# EAGLE design microBoard_DRV8843 (EAGLE 6.2)
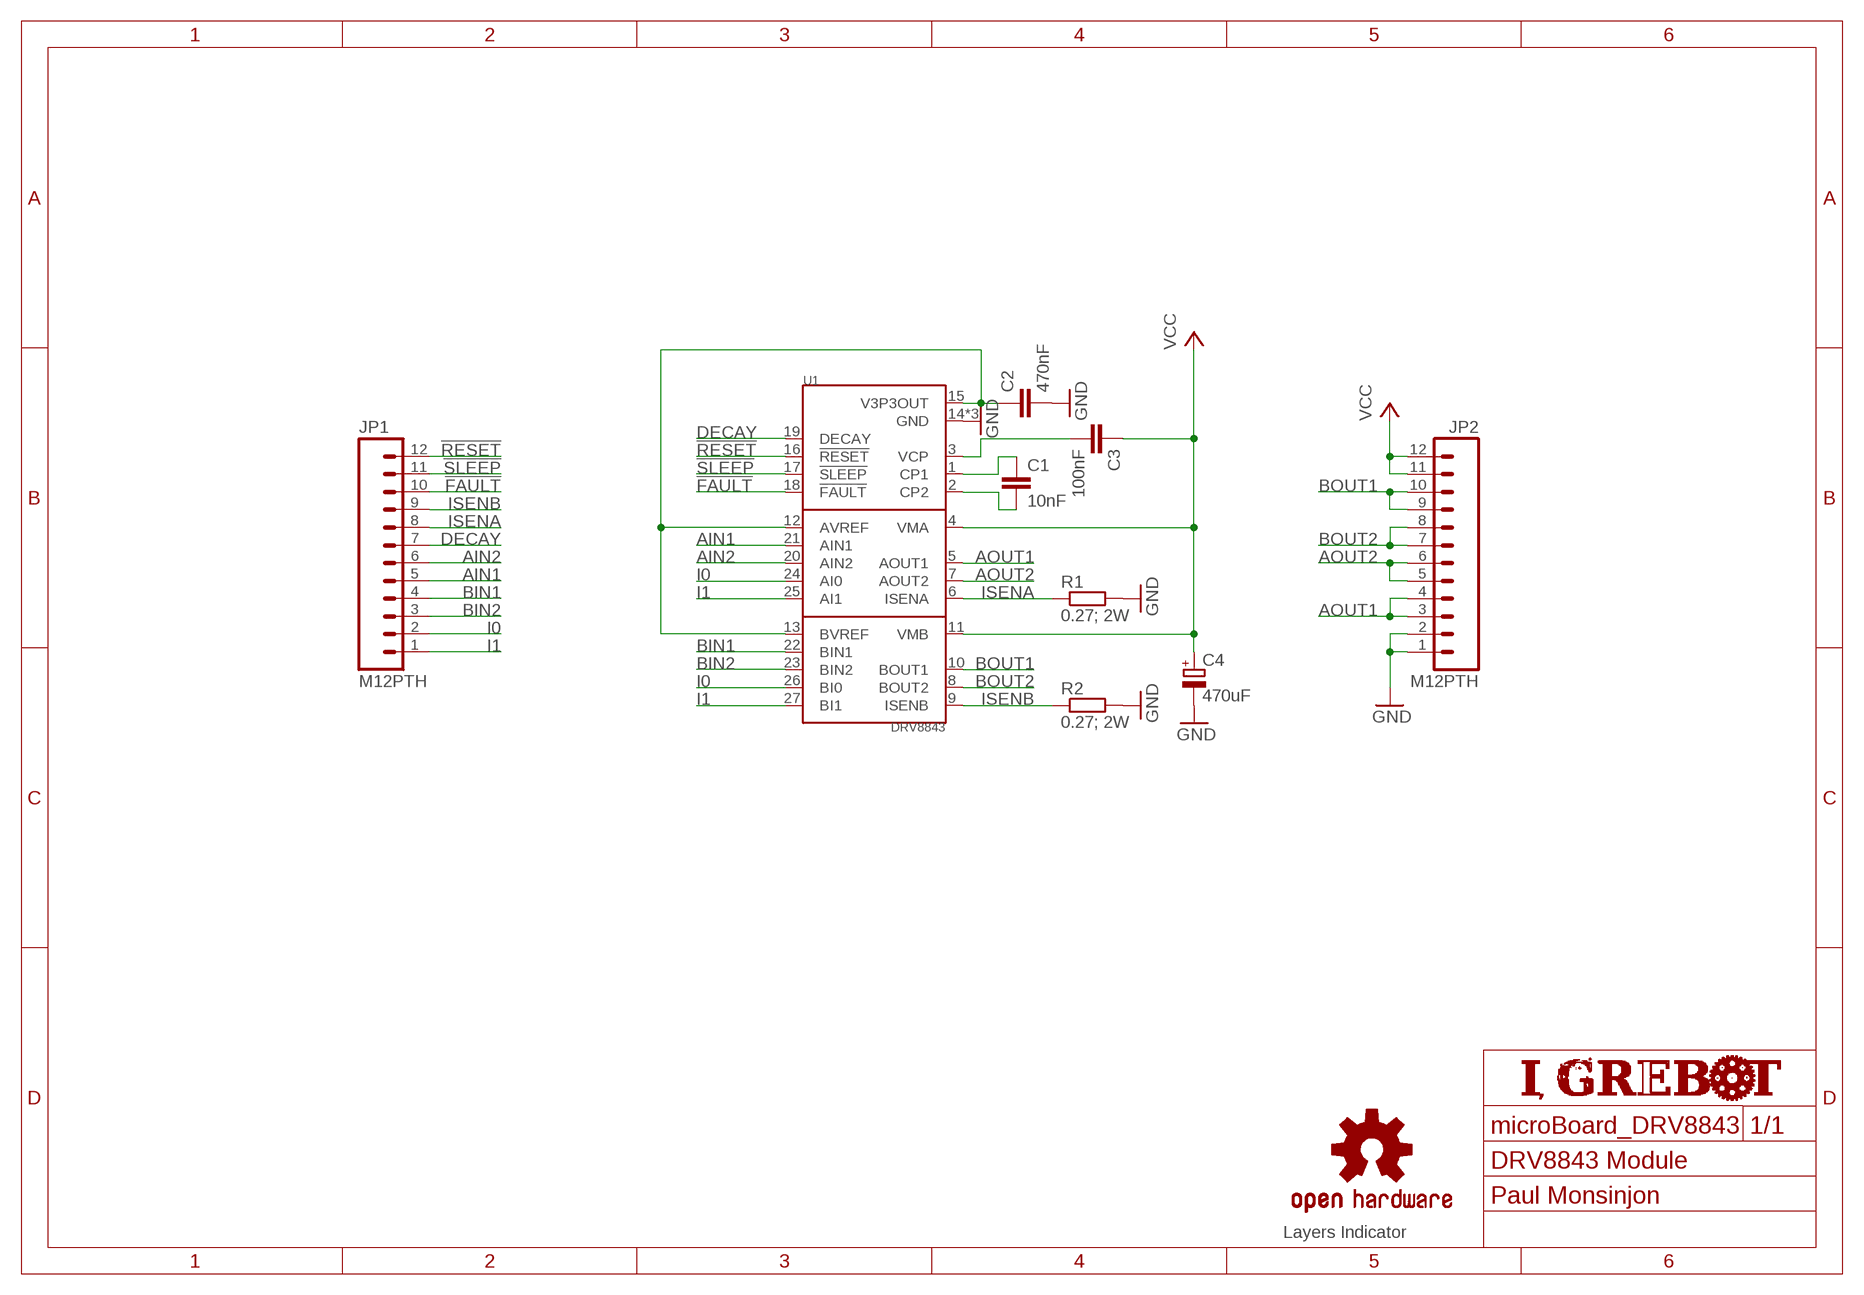
[diagram p0: schematic, sheet 1]
FRAME1 (FRAME_A4): AUTHOR: Paul Monsinjon; SHEET_NAME: DRV8843 Module

## Parts
C1  10nF  C-EUC0603  [C0603]
C2  470nF  C-EUC0603  [C0603]
C3  100nF  C-EUC0603  [C0603]
C4  470uF  CPOL-EUD  [PANASONIC_D]
JP1  M12PTH  [1X12]
JP2  M12PTH  [1X12]
LOGO1  OSHW-LOGOS  [OSHW-LOGO-S]
R1  0.27; 2W  R-EU_R2010  [R2010]
R2  0.27; 2W  R-EU_R2010  [R2010]
U1  DRV8843  [PWP_28]
U$1  LOGO_IGREBOT12X2MM  [IGREBOT_12X2MM]
U$2  LAYERS_CHECK4_LAYERS  [LAYERS_CHECK_4]

## Nets
!FAULT!: JP1.10 U1.18(!FAULT!)
!RESET!: JP1.12 U1.16(!RESET!)
!SLEEP!: JP1.11 U1.17(!SLEEP!)
AIN1: JP1.5 U1.21(AIN1)
AIN2: JP1.6 U1.20(AIN2)
AOUT1: JP2.3 JP2.4 U1.5(AOUT1)
AOUT2: JP2.5 JP2.6 U1.7(AOUT2)
BIN1: JP1.4 U1.22(BIN1)
BIN2: JP1.3 U1.23(BIN2)
BOUT1: JP2.9 JP2.10 U1.10(BOUT1)
BOUT2: JP2.7 JP2.8 U1.8(BOUT2)
DECAY: JP1.7 U1.19(DECAY)
GND: C2.2 C4.- JP2.1 JP2.2 R1.2 R2.2 U1.14(GND) U1.28(GND) U1.PPAD(GND)
I0: JP1.2 U1.24(AI0) U1.26(BI0)
I1: JP1.1 U1.25(AI1) U1.27(BI1)
ISENA: JP1.8 R1.1 U1.6(ISENA)
ISENB: JP1.9 R2.1 U1.9(ISENB)
N$29: C1.2 U1.2(CP2)
N$30: C1.1 U1.1(CP1)
N$31: C3.2 U1.3(VCP)
N$32: C2.1 U1.12(AVREF) U1.13(BVREF) U1.15(V3P3OUT)
VCC: C3.1 C4.+ JP2.11 JP2.12 U1.4(VMA) U1.11(VMB)

## Library data of the parts
C1-C3 = rcl:C-EU: CAPACITOR, European symbol
C4 = rcl:CPOL-EU: POLARIZED CAPACITOR, European symbol
JP1 JP2 = SparkFun-Connectors:M12: Header 12 Standard 12-pin 0.1" header. Use with straight break away headers (SKU : PRT-00116), right angle break away headers (PRT-00553), swiss pins (PRT-00743), machine pins (PRT-00117), and female headers (PRT-00115).
LOGO1 = SparkFun-Aesthetics:OSHW-LOGO: Open Source Hardware Logo This logo indicates the piece of hardware it is found on incorporates a OSHW license and/or adheres to the definition of open source hardware found here: http://freedomdefined.org/OSHW
R1 R2 = rcl:R-EU_: RESISTOR, European symbol
U1 = microLib:DRV8843
U$1 = microLib:LOGO_IGREBOT
U$2 = microLib:LAYERS_CHECK

## Board
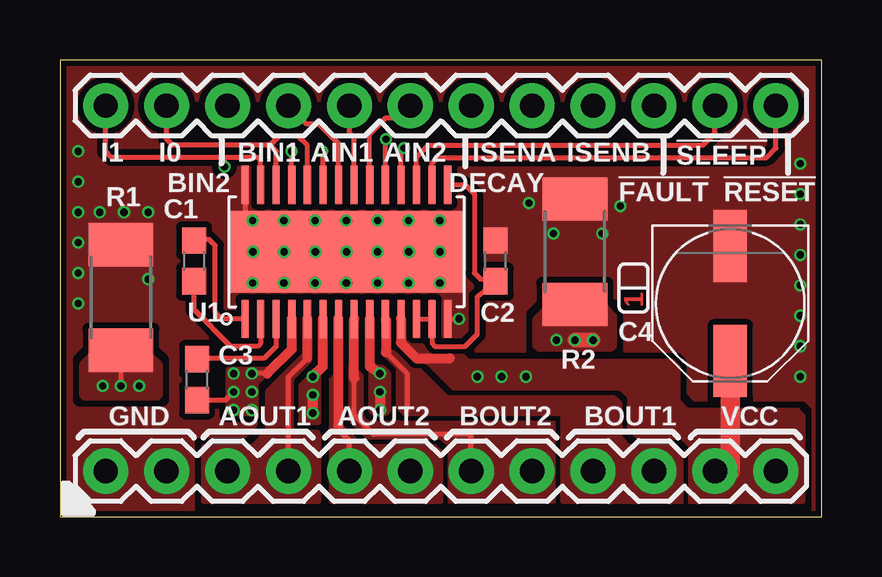
[diagram p1: board, top side]
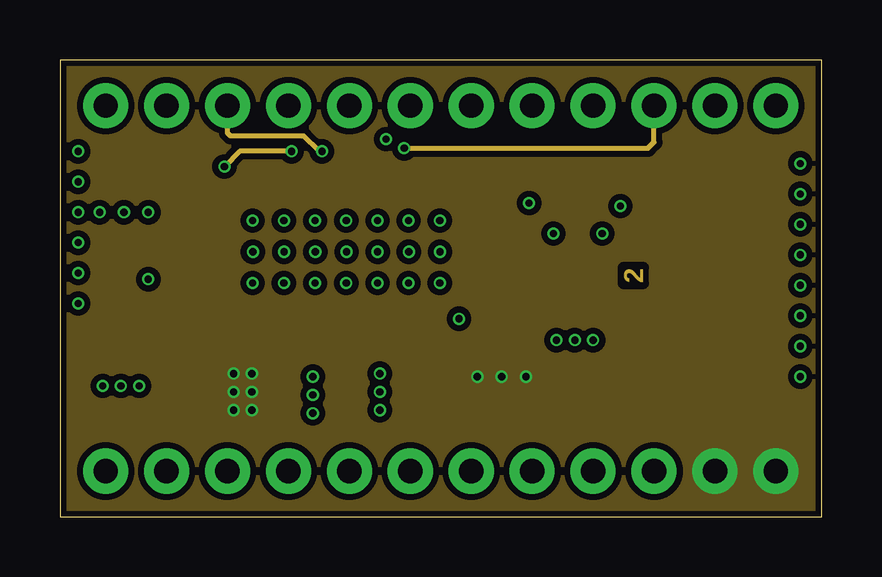
[diagram p2: board, inner layer Route2]
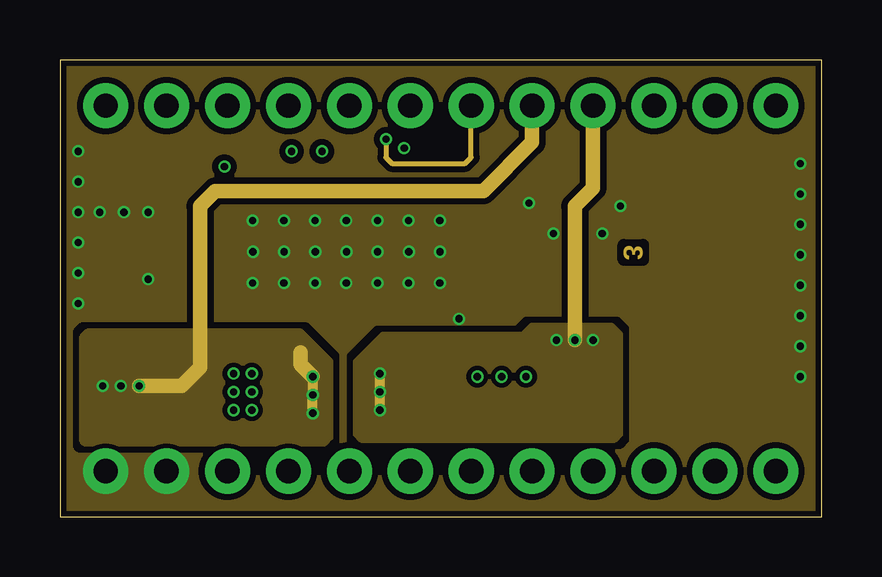
[diagram p3: board, inner layer Route15]
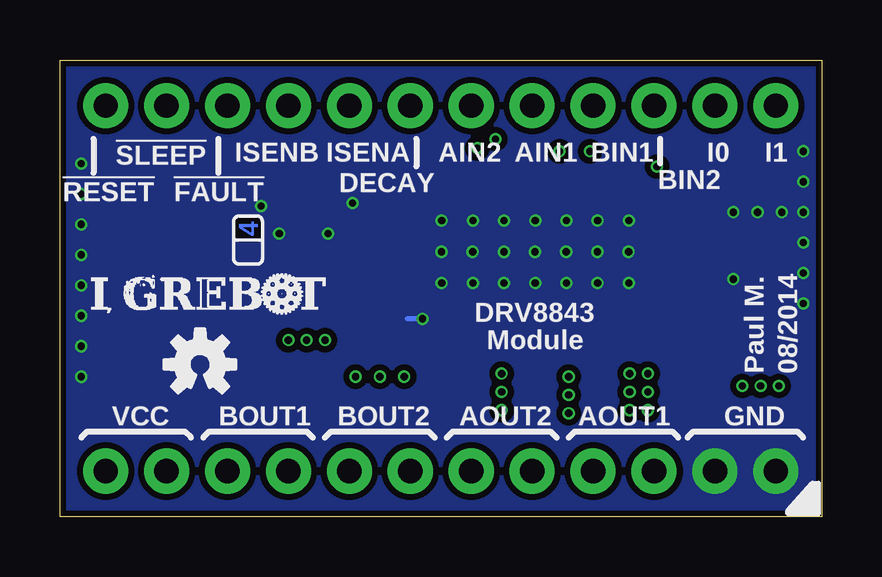
[diagram p4: board, bottom side, seen from below]

Size 31.75 x 19.05 mm. Coordinates in mm from the lower left corner, seen from the top.
Outline: 0,0 31.75,0 31.75,19.05 0,19.05 0,0
Copper layers (1*2*15*16): Top 0.035mm / dielectric 0.2mm / Route2 0.0175mm / dielectric 0.3mm / Route15 0.0175mm / dielectric 0.2mm / Bottom 0.035mm
Design rules: minimum track width 8mil, minimum drill 0.3mm, track to track 8mil, track to pad 8mil, pad to pad 8mil, via to via 8mil, smd to smd 0mil, copper to edge 10mil, drill to drill 8mil, minimum pad ring 6mil, minimum via ring 4mil, stop-mask expansion 4mil, vias tented up to drill 100mil, thermal gap 10mil

### Footprints (pad centres in the part's own frame; a part is rotated, then mirrored left to right if it is on the bottom)
C0603 = smd 1.1 x 1: 1 -0.85,0; 2 0.85,0
PANASONIC_D = smd 3 x 1.4: + 2.4,0; - -2.4,0
1X12 = drill 1.016 pad 1.88: 1 0,0; 2 2.54,0; 3 5.08,0; 4 7.62,0; 5 10.16,0; 6 12.7,0; 7 15.24,0; 8 17.78,0; 9 20.32,0; 10 22.86,0; 11 25.4,0; 12 27.94,0
R2010 = smd 1.8 x 2.7: 1 -2.2,0; 2 2.2,0
PWP_28 = smd 0.3 x 1.6: 1 -4.225,-2.8; 2 -3.575,-2.8; 3 -2.925,-2.8; 4 -2.275,-2.8; 5 -1.625,-2.8; 6 -0.975,-2.8; 7 -0.325,-2.8; 8 0.325,-2.8; 9 0.975,-2.8; 10 1.625,-2.8; 11 2.275,-2.8; 12 2.925,-2.8; 13 3.575,-2.8; 14 4.225,-2.8; 15 4.225,2.8; 16 3.575,2.8; 17 2.925,2.8; 18 2.275,2.8; 19 1.625,2.8; 20 0.975,2.8; 21 0.325,2.8; 22 -0.325,2.8; 23 -0.975,2.8; 24 -1.625,2.8; 25 -2.275,2.8; 26 -2.925,2.8; 27 -3.575,2.8; 28 -4.225,2.8 | smd 9.7 x 3.4: PPAD 0,0

### Placement (x,y rotation side)
C1  5.59,10.67 270 top
C2  18.16,10.67 90 top
C3  5.71,5.71 90 top
C4  27.94,8.89 270 top
JP1  1.91,17.14 0 top
JP2  1.91,1.91 0 top
LOGO1  25.91,6.35 0 bottom
R1  2.54,9.14 90 top
R2  21.46,11.05 90 top
U1  11.94,11.05 0 top
U$1  30.48,8.64 0 bottom
U$2  24.51,10.54 90 top

### Tracks (layer width: path | path; a pad name or v marks a point on that pad's centre or on a via)
!FAULT!  (via drill 0.3)
  Top 0.203: U1.18 14.21,15.23 v14.35,15.37
  Route2 0.203: v14.35,15.37 24.51,15.37 24.77,15.62 JP1.10
!RESET!
  Top 0.203: U1.16 15.51,14.75 15.75,14.99 29.46,14.99 29.84,15.37 JP1.12
!SLEEP!
  Top 0.203: U1.17 14.86,14.99 15.37,15.49 26.8,15.49 27.3,16 JP1.11
AIN1
  Top 0.203: U1.21 12.26,15.8 12.06,16 JP1.5
AIN2
  Top 0.203: U1.20 12.91,15.96 13.59,16.64 14.1,16.64 JP1.6
AOUT1
  Top 0.203: JP2.4 9.53,5.84 10.31,6.63
  Top 0.406: 10.31,6.63 U1.5
  pour Top (rank 3, no thermals): 10.16,6.73 8.64,5.21 8.64,3.56 8,2.92 5.97,2.92 5.97,0.64 10.79,0.64 10.79,3.43 10.54,3.68 10.03,3.68 9.78,3.94 9.78,5.84 10.41,6.48 10.41,6.73
AOUT2
  Top 0.203: JP2.5 12.06,3.17 11.61,3.63
  Top 0.406: 11.61,3.63 U1.7
  pour Top (isolate 0.203, rank 2, no thermals): 11.68,6.1 11.3,5.71 11.3,0.64 15.88,0.64 15.88,2.67 15.62,2.92 12.57,2.92 11.68,3.81
BIN1
  Top 0.203: U1.22 11.61,15.56 10.79,16.38 10.29,16.38 JP1.4
BIN2  (via drill 0.3)
  Top 0.203: U1.23 10.96,15.2 v10.92,15.24
  Route2 0.203: v10.92,15.24 10.79,15.24 10.16,15.88 7.11,15.88 6.99,16 JP1.3
BOUT1
  Top 0.203: 13.59,6.86 14.48,5.97 14.48,4.45 | U1.10 13.59,8.22
  Top 0.406: 13.59,8.22 13.59,6.86
  pour Top (rank 2, no thermals): 13.59,6.73 14.1,6.22 14.1,4.57 14.35,4.32 20.95,4.32 20.95,0.64 25.91,0.64 25.91,2.67 25.65,2.92 23.75,2.92 23.37,3.3 23.37,4.7 23.11,4.95 16.13,4.95 14.99,6.1 14.73,6.1 13.97,6.86 13.72,6.86
BOUT2
  Top 0.203: JP2.7 17.14,3.43 13.08,3.43 12.26,4.25 12.26,5.77
  Top 0.406: 12.26,5.77 U1.8
  pour Top (rank 3, no thermals): 12.06,6.35 12.57,5.84 12.57,4.45 13.08,3.94 20.7,3.94 20.7,0.64 16.13,0.64 16.13,2.92 15.88,3.17 12.83,3.17 12.06,3.81
DECAY  (via drill 0.3)
  Top 0.203: U1.19 13.56,15.72 v13.59,15.75
  Route15 0.203: v13.59,15.75 13.59,14.99 13.84,14.73 16.89,14.73 17.14,14.99 JP1.7
GND  (via drill 0.3)
  Top 0.203: U1.14 v16.63,8.25 v16.64,8.26 | U1.28 7.71,12.67 v8.04,12.35
  Bottom 0.203: v16.64,8.26 17.27,8.26
  other vias: 15.84,12.35 14.54,12.35 13.23,12.35 11.94,12.35 10.63,12.35 9.34,12.35 15.85,11.05 14.54,11.05 13.24,11.05 11.95,11.05 10.64,11.05 9.35,11.05 8.04,11.05 15.84,9.75 14.54,9.75 13.23,9.75 11.94,9.75 10.63,9.75 9.34,9.75 8.04,9.75 1.65,12.7 2.67,12.7 3.68,12.7 19.56,13.08 23.37,12.95 20.57,11.81 22.61,11.81 3.68,9.91 0.76,15.24 0.76,13.97 0.76,12.7 0.76,11.43 0.76,10.16 0.76,8.89 30.86,14.73 30.86,13.46 30.86,12.19 30.86,10.92 30.86,9.65 30.86,7.11 30.86,8.38 30.86,5.84
  pour Route15 (isolate 0.254, rank 6, no thermals): 0,0 31.75,0 31.75,19.05 0,19.05
  pour Bottom (isolate 0.254, no thermals): 0,0 31.75,0 31.75,19.05 0,19.05
  pour Top (isolate 0.254, rank 6, no thermals): 0,0 31.75,0 31.75,19.05 0,19.05
I0
  Top 0.203: U1.26 9.01,15.24 8.76,15.49 | 8.76,15.49 4.7,15.49 4.45,15.75 JP1.2 | U1.24 10.31,15.47 9.91,15.88 9.14,15.88 8.76,15.49
I1  (via drill 0.3)
  Top 0.203: U1.27 8.36,14.88 8.26,14.99 6.86,14.99 | 6.86,14.99 2.16,14.99 1.91,15.24 JP1.1 | U1.25 9.66,15.23 v9.65,15.24 | v6.86,14.61 6.86,14.99
  Route2 0.203: v9.65,15.24 7.49,15.24 v6.86,14.61
ISENA  (via drill 0.3)
  Top 0.203: R1.1 v2.54,5.46
  Top 0.406: v10.54,5.84 10.96,6.26 U1.6 | v10.54,5.08 v10.54,4.32
  Route15 0.406: v10.54,5.84 v10.54,5.08 v10.54,4.32
  Route15 0.61: JP1.8 19.68,15.62 17.65,13.59 6.48,13.59 5.84,12.95 5.84,6.22 5.08,5.46 v3.3,5.46 | 10.03,6.86 10.03,6.35 v10.54,5.84
  other vias: 1.78,5.46
  pour Top (isolate 0.254, rank 2, no thermals): 10.79,6.22 10.03,5.46 10.03,3.94 10.79,3.94 10.79,5.97 11.05,6.22
  pour Route15 (rank 2, no thermals): 0.89,7.49 0.89,3.17 1.02,3.05 11.05,3.05 11.3,3.3 11.3,6.48 10.03,7.75 1.14,7.75
  pour Top (rank 2, no thermals): 1.27,6.73 0.89,6.35 0.89,5.08 1.02,4.95 4.06,4.95 4.19,5.08 4.19,6.35 3.81,6.73
ISENB  (via drill 0.3)
  Top 0.406: U1.9 12.91,6.26 v13.34,5.97 | v13.34,5.21 v13.34,4.45
  Top 0.61: v21.46,7.37 v22.23,7.37
  Route15 0.406: v13.34,4.45 v13.34,5.21 v13.34,5.97
  Route15 0.61: JP1.9 22.23,13.72 21.46,12.95 v21.46,7.37
  other vias: 20.7,7.37
  pour Top (rank 2): 12.95,6.22 12.95,4.45 13.08,4.32 13.59,4.32 13.72,4.45 13.72,5.97 13.46,6.22 13.21,6.22 13.08,6.35
  pour Top (no thermals): 20.32,8.76 22.73,8.76 23.11,8.38 23.11,7.11 22.99,6.99 19.94,6.99 19.81,7.11 19.81,8.26
  pour Route15 (no thermals): 12.32,3.43 12.32,6.48 13.46,7.62 19.3,7.62 19.68,8 22.99,8 23.37,7.62 23.37,3.43 23.11,3.17 12.57,3.17
N$29
  Top 0.203: U1.2 8.36,7.22 8.26,7.11 7.11,7.11 5.59,8.64 C1.2
N$30
  Top 0.203: U1.1 6.74,8.25 6.48,8.51 6.48,11.3 6.22,11.56 5.75,11.56 C1.1
N$31
  Top 0.203: U1.3 9.01,7.11 8.51,6.6 5.75,6.6 C3.2
N$32
  Top 0.203: U1.12 U1.13 15.51,7.22 15.62,7.11 16.89,7.11 17.4,7.62 17.4,9.18 C2.1 17.95,9.91 17.53,9.91 17.27,10.16 17.27,13.46 16.89,13.85 U1.15
VCC  (via drill 0.3)
  Top 0.203: U1.4 9.65,6.99 | 8.64,5.97 v8,5.97 | C3.1 6.9,4.87 v7.24,5.21
  Top 0.406: U1.4 9.66,7 9.65,6.99 8.64,5.97 | U1.11 14.21,7.25 14.86,6.6 16.26,6.6
  Top 0.813: JP2.11 27.94,1.91 C4.+
  other vias: 7.24,5.97 8,5.21 8,4.45 7.24,4.45 17.4,5.84 18.41,5.84 19.43,5.84
  pour Top (rank 4, no thermals): 15.24,6.48 16.38,5.33 23.37,5.33 23.75,4.95 23.75,3.68 24.13,3.3 25.65,3.3 26.16,2.79 26.16,0.64 30.99,0.64 30.99,4.19 30.73,4.45 26.16,4.45 25.78,4.83 25.78,6.22 25.53,6.48 17.02,6.48 16.76,6.73 15.49,6.73 14.99,7.24 14.1,7.24 14.86,6.48
  pour Top (isolate 0.254, rank 4): 8.89,6.22 7.11,6.22 6.99,6.1 6.99,4.45 7.11,4.32 8.26,4.32 8.38,4.45 8.38,5.59 8.89,6.1
  pour Route2 (isolate 0.254, no thermals): 0,0 31.75,0 31.75,19.05 0,19.05

### Text on the board
tNames: I1 | I0 | BIN1 | AIN1 | AIN2 | ISENA | ISENB | !SLEEP! | BIN2 | DECAY | !FAULT! | !RESET! | GND | AOUT1 | AOUT2 | BOUT2 | BOUT1 | VCC
bNames: I1 | I0 | BIN1 | AIN1 | AIN2 | ISENA | ISENB | !SLEEP! | BIN2 | DECAY | !FAULT! | !RESET! | DRV8843 | Module | 08/2014 | Paul M. | GND | AOUT1 | AOUT2 | BOUT2 | BOUT1 | VCC